# EAGLE schematic piHat_v0 (EAGLE 9.5.2)
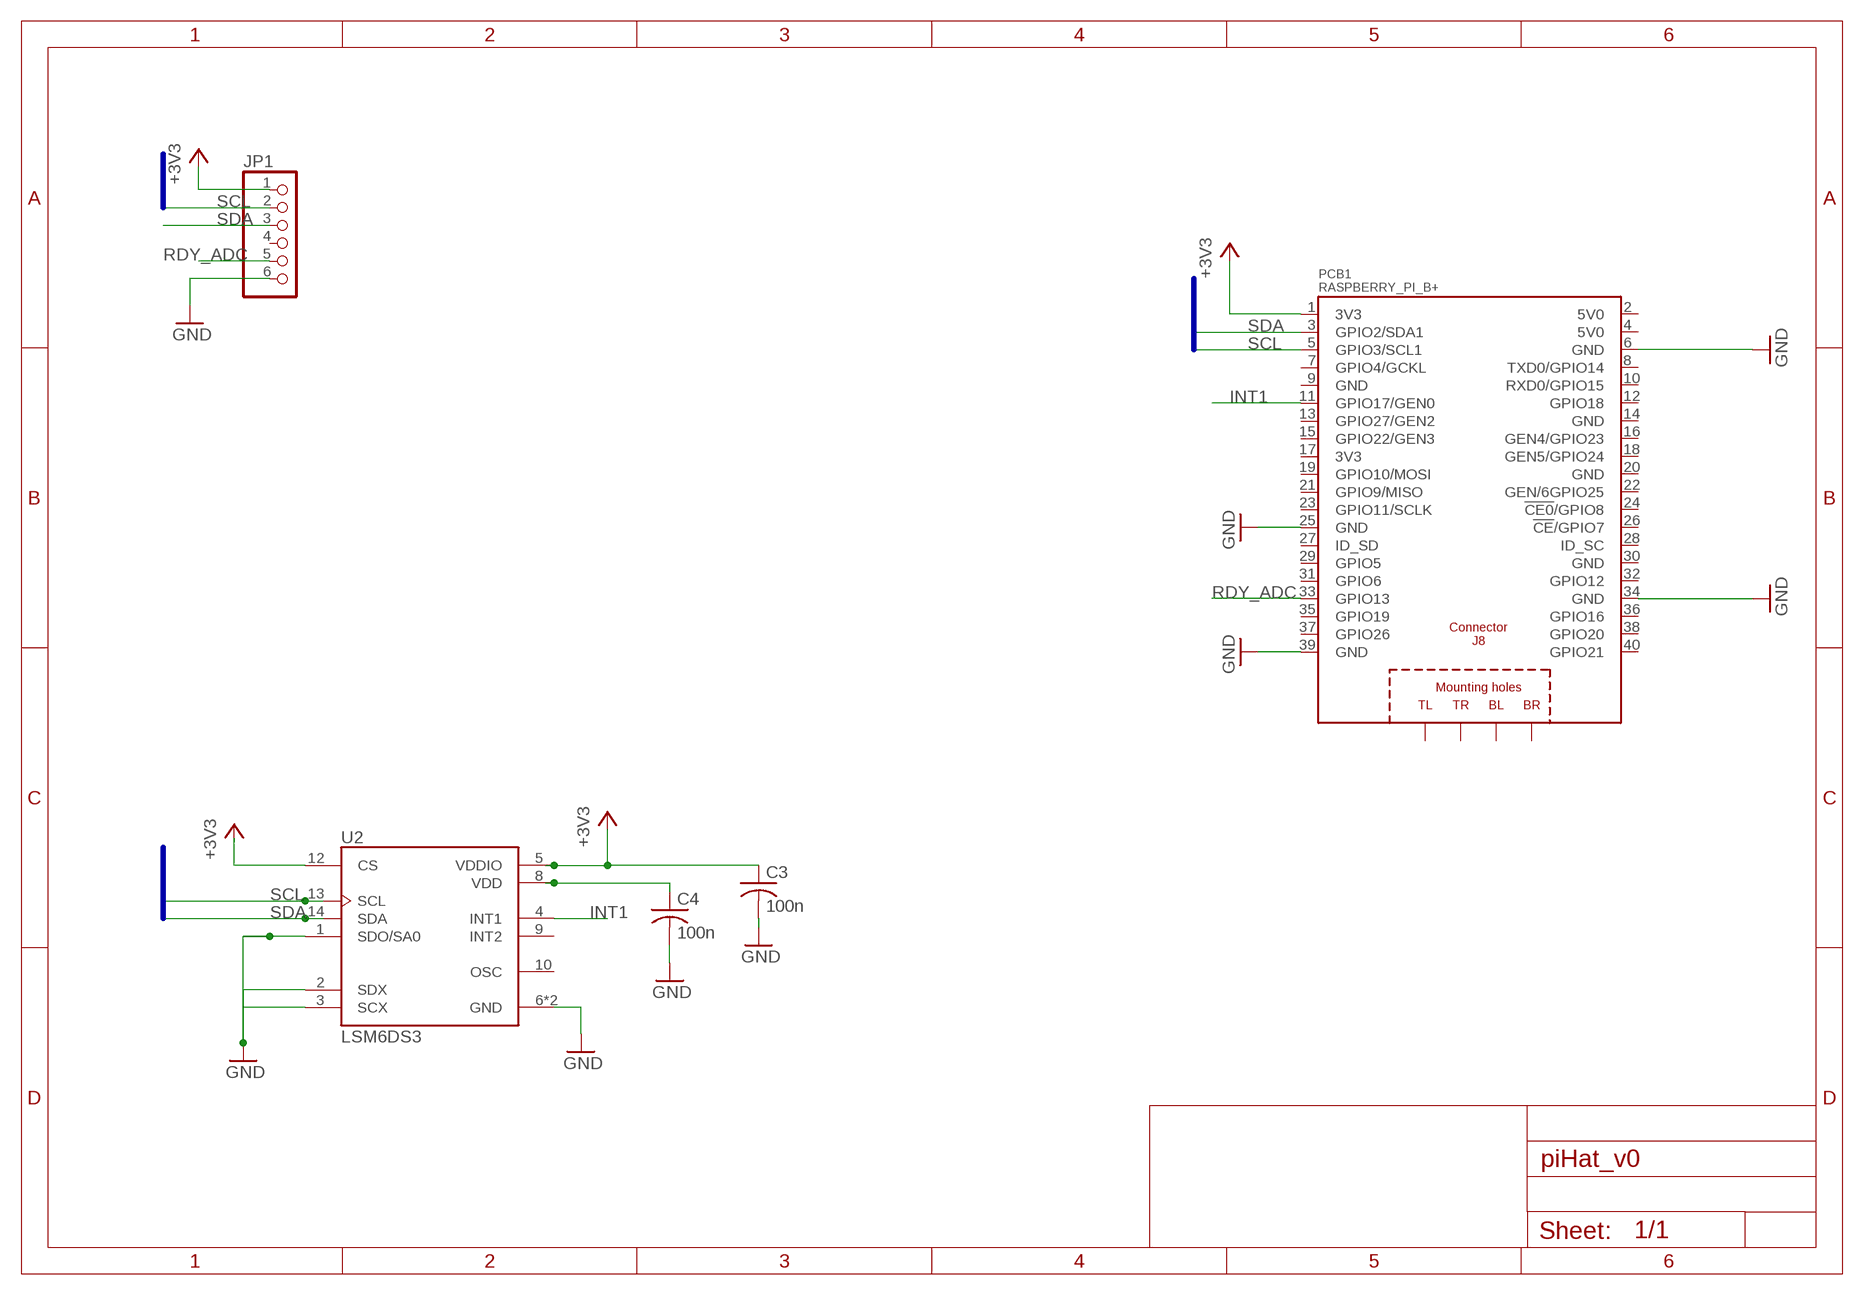
[diagram p0: schematic, sheet 1]

## Parts
C3  100n  C-USC1206  [C1206]
C4  100n  C-USC1206  [C1206]
JP1  PINHD-1X6  [1X06]
PCB1  RASPBERRY_PI_B+  [RASPBERRY_PI_B+]
U2  LSM6DS3  [PQFN50P300X250X86-14N]

## Nets
+3V3: C3.1 JP1.1 PCB1.1(3V3) U2.5(VDDIO) U2.12(CS)
GND: C3.2 C4.2 JP1.6 PCB1.6(GND) PCB1.25(GND) PCB1.39(GND) U2.1(SDO/SA0) U2.2(SDX) U2.3(SCX) U2.6(GND) U2.7(GND)
GND@7: PCB1.34(GND) ; supply symbol labelled GND
INT1: PCB1.11(GPIO17/GEN0) U2.4(INT1)
N$6: C4.1 U2.8(VDD)
RDY_ADC: JP1.5 PCB1.33(GPIO13)
SCL: JP1.2 PCB1.5(GPIO3/SCL1) U2.13(SCL)
SDA: JP1.3 PCB1.3(GPIO2/SDA1) U2.14(SDA)
Unconnected: JP1.4 PCB1.2(5V0) PCB1.4(5V0) PCB1.7(GPIO4/GCKL) PCB1.8(TXD0/GPIO14) PCB1.9(GND) PCB1.10(RXD0/GPIO15) PCB1.12(GPIO18) PCB1.13(GPIO27/GEN2) PCB1.14(GND) PCB1.15(GPIO22/GEN3) PCB1.16(GEN4/GPIO23) PCB1.17(3V3) PCB1.18(GEN5/GPIO24) PCB1.19(GPIO10/MOSI) PCB1.20(GND) PCB1.21(GPIO9/MISO) PCB1.22(GEN/6GPIO25) PCB1.23(GPIO11/SCLK) PCB1.24(!CE0!/GPIO8) PCB1.26(!CE!/GPIO7) PCB1.27(ID_SD) PCB1.28(ID_SC) PCB1.29(GPIO5) PCB1.30(GND) PCB1.31(GPIO6) PCB1.32(GPIO12) PCB1.35(GPIO19) PCB1.36(GPIO16) PCB1.37(GPIO26) PCB1.38(GPIO20) PCB1.40(GPIO21) PCB1.PE_BL(BL) PCB1.PE_BR(BR) PCB1.PE_TL(TL) PCB1.PE_TR(TR) U2.9(INT2) U2.10(OSC)

## Buses
SCL,SDA
I2C:SCL,SDA

## Library data of the parts
C3 C4 = rcl:C-US: CAPACITOR, American symbol; SPICEPREFIX: C
JP1 = pinhead:PINHD-1X6: PIN HEADER
PCB1 = RASPBERRY_PI_B_:RASPBERRY_PI_B+: Raspberry Pi B+ Based on issue: Thursday, July 10, 2014 - Rev 1.2 LBR by Tim R. 07-2014; AVAILABILITY: Unavailable; DESCRIPTION: Case Plastic, ABS Black Hand Held, Split Sides 3.520 L x 2.740 W _89.41mm x 69.60mm_ X 0.980 _24.89mm_; MF: Raspberry Pi; MP: RASPBERRY PI B+; PACKAGE: None; PRICE: None
U2 = LSM6DS3:LSM6DS3: iNEMO inertial module: 3D accelerometer and 3D gyroscope; AVAILABILITY: Unavailable; DESCRIPTION: LSM6DS33 - Accelerometer, Gyroscope, 6 Axis Sensor Evaluation Board; MF: STMicroelectronics; MP: LSM6DS3; PACKAGE: LGA-14 STMicroelectronics; PRICE: None